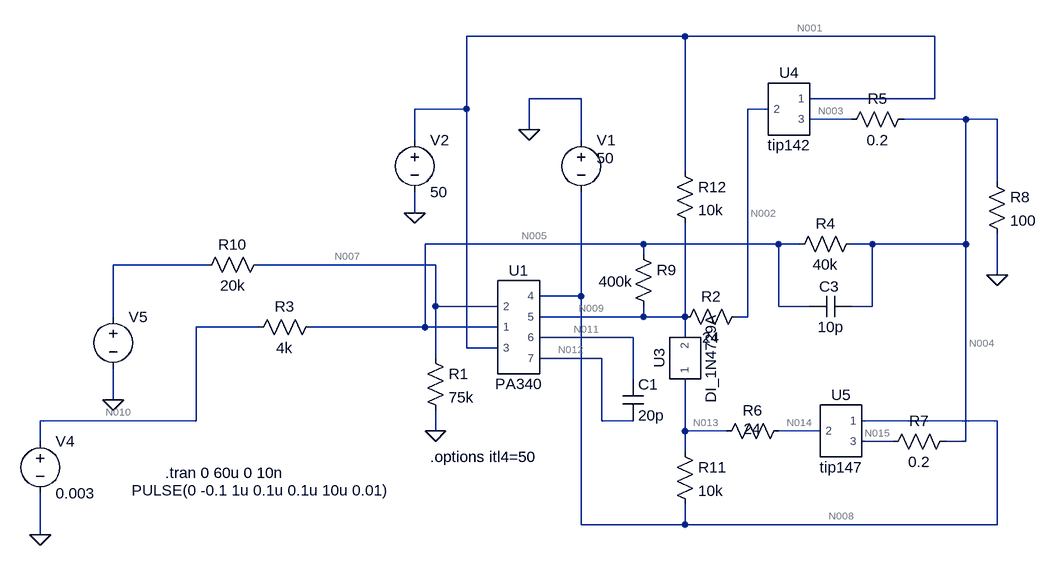
[diagram p0: schematic Draft16.asc]
Draft16.asc, the LTspice schematic file:
Version 4
SHEET 1 1672 680
WIRE 448 -288 112 -288
WIRE 832 -288 448 -288
WIRE 288 -192 208 -192
WIRE 832 -192 832 -288
WIRE 832 -192 640 -192
WIRE 112 -176 112 -288
WIRE 112 -176 32 -176
WIRE 576 -176 544 -176
WIRE 704 -160 640 -160
WIRE 880 -160 784 -160
WIRE 928 -160 880 -160
WIRE 208 -144 208 -192
WIRE 32 -128 32 -176
WIRE 288 -128 288 -192
WIRE 448 -80 448 -288
WIRE 928 -64 928 -160
WIRE 32 -16 32 -48
WIRE 384 32 48 32
WIRE 592 32 384 32
WIRE 624 32 592 32
WIRE 736 32 704 32
WIRE 880 32 880 -160
WIRE 880 32 736 32
WIRE 384 48 384 32
WIRE -288 64 -432 64
WIRE 64 64 -208 64
WIRE 928 80 928 16
WIRE 288 112 288 -48
WIRE 288 112 224 112
WIRE 64 128 64 64
WIRE 160 128 64 128
WIRE 592 128 592 32
WIRE 640 128 592 128
WIRE 736 128 736 32
WIRE 736 128 704 128
WIRE -432 144 -432 64
WIRE 384 144 384 128
WIRE 384 144 224 144
WIRE 448 144 448 0
WIRE 448 144 384 144
WIRE 544 144 544 -176
WIRE 544 144 528 144
WIRE -208 160 -304 160
WIRE 48 160 48 32
WIRE 48 160 -128 160
WIRE 160 160 48 160
WIRE 368 176 224 176
WIRE 448 176 448 144
WIRE 112 192 112 -176
WIRE 160 192 112 192
WIRE 64 208 64 128
WIRE 320 208 224 208
WIRE 368 240 368 176
WIRE -432 272 -432 224
WIRE -304 304 -304 160
WIRE -304 304 -544 304
WIRE 320 304 320 208
WIRE 368 304 320 304
WIRE 928 304 720 304
WIRE 64 320 64 288
WIRE 448 320 448 240
WIRE 512 320 448 320
WIRE 656 320 592 320
WIRE -544 336 -544 304
WIRE 768 336 720 336
WIRE 880 336 880 32
WIRE 880 336 848 336
WIRE 448 352 448 320
WIRE 288 464 288 112
WIRE 448 464 448 432
WIRE 448 464 288 464
WIRE 928 464 928 304
WIRE 928 464 448 464
WIRE -544 480 -544 416
FLAG 32 -16 0
FLAG 208 -144 0
FLAG -544 480 0
FLAG 928 80 0
FLAG -432 272 0
FLAG 64 320 0
SYMBOL PA340 192 160 R0
SYMATTR InstName U1
SYMBOL res 48 192 R0
SYMATTR InstName R1
SYMATTR Value 75k
SYMBOL res 544 128 R90
WINDOW 0 0 56 VBottom 2
WINDOW 3 32 56 VTop 2
SYMATTR InstName R2
SYMATTR Value 24
SYMBOL res -112 144 R90
WINDOW 0 0 56 VBottom 2
WINDOW 3 32 56 VTop 2
SYMATTR InstName R3
SYMATTR Value 4k
SYMBOL cap 352 240 R0
SYMATTR InstName C1
SYMATTR Value 20p
SYMBOL voltage 288 -144 R0
WINDOW 3 24 44 Left 2
WINDOW 123 0 0 Left 0
WINDOW 39 0 0 Left 0
SYMATTR Value 50
SYMATTR InstName V1
SYMBOL voltage 32 -144 R0
WINDOW 123 0 0 Left 0
WINDOW 39 0 0 Left 0
SYMATTR InstName V2
SYMATTR Value 50
SYMBOL res 912 -80 R0
SYMATTR InstName R8
SYMATTR Value 100
SYMBOL res 720 16 R90
WINDOW 0 0 56 VBottom 2
WINDOW 3 32 56 VTop 2
SYMATTR InstName R4
SYMATTR Value 40k
SYMBOL cap 704 112 R90
WINDOW 0 1 34 VBottom 2
WINDOW 3 32 32 VTop 2
SYMATTR InstName C3
SYMATTR Value 10p
SYMBOL res -192 48 R90
WINDOW 0 0 56 VBottom 2
WINDOW 3 32 56 VTop 2
SYMATTR InstName R10
SYMATTR Value 20k
SYMBOL voltage -432 128 R0
WINDOW 123 0 0 Left 0
WINDOW 39 0 0 Left 0
WINDOW 3 29 283 Left 2
SYMATTR Value PULSE(0 -0.1 1u 0.1u 0.1u 10u 0.01)
SYMATTR InstName V5
SYMBOL res 608 304 R90
WINDOW 0 0 56 VBottom 2
WINDOW 3 28 56 VBottom 2
SYMATTR InstName R6
SYMATTR Value 24
SYMBOL voltage -544 320 R0
WINDOW 123 0 0 Left 0
WINDOW 39 0 0 Left 0
SYMATTR InstName V4
SYMATTR Value 0.003
SYMBOL tip142 608 -176 R0
SYMATTR InstName U4
SYMBOL tip147 688 320 R0
SYMATTR InstName U5
SYMBOL res 800 -176 R90
WINDOW 0 0 56 VBottom 2
WINDOW 3 32 56 VTop 2
SYMATTR InstName R5
SYMATTR Value 0.2
SYMBOL res 864 320 R90
WINDOW 0 0 56 VBottom 2
WINDOW 3 32 56 VTop 2
SYMATTR InstName R7
SYMATTR Value 0.2
SYMBOL res 368 32 R0
WINDOW 3 -53 58 Left 2
SYMATTR Value 400k
SYMATTR InstName R9
SYMBOL res 432 336 R0
SYMATTR InstName R11
SYMATTR Value 10k
SYMBOL res 432 -96 R0
SYMATTR InstName R12
SYMATTR Value 10k
SYMBOL 1N4729A 448 208 R270
SYMATTR InstName U3
TEXT -352 384 Left 2 !.tran 0 60u 0 10n
TEXT 56 360 Left 2 !.options itl4=50

The netlist it stands for:
* Draft16.asc
XU1 N007 N005 N001 N008 N009 N011 N012 PA340  ; pins 2 1 3 4 5 6 7
R1 N007 0 75k
R2 N002 N009 24
R3 N005 N010 4k
C1 N011 N012 20p
V1 0 N008 50
V2 N001 0 50
R8 N004 0 100
R4 N004 N005 40k
C3 N004 N005 10p
R10 N007 N006 20k
V5 N006 0 PULSE(0 -0.1 1u 0.1u 0.1u 10u 0.01)
R6 N014 N013 24
V4 N010 0 0.003
XU4 N001 N002 N003 tip142  ; pins 1 2 3
XU5 N008 N014 N015 tip147  ; pins 1 2 3
R5 N004 N003 0.2
R7 N004 N015 0.2
R9 N005 N009 400k
R11 N013 N008 10k
R12 N001 N009 10k
XU3 N013 N009 DI_1N4729A  ; pins 1 2
.tran 0 60u 0 10n
.options itl4=50
.lib PA340_Pspice.LIB
.lib TIP142.cir
.lib TIP147.cir
.lib D:\1-LTspise\BASE_MOSFET\1N4729A.cir
.backanno
.end

* Results of the author's LTspice run, read from the files saved beside the schematic
* Operating Point, zero values left out:
*   V(n001) = 50 V
*   V(n008) = -50 V
*   V(n011) = -1.344 mV
*   V(n012) = 1.68 V
*   V(n009) = 1.662 V
*   V(n005) = 12.03 mV
*   V(n007) = -868.4 nV
*   V(n002) = 1.652 V
*   V(n010) = 3 mV
*   V(n004) = -62.71 mV
*   V(n014) = -1.657 V
*   V(n013) = -1.662 V
*   V(n003) = -59.09 mV
*   V(n015) = -66.45 mV
*   I(R12) = 4.834 mA
*   I(R11) = 4.834 mA
*   I(R9) = -4.125 µA
*   I(R7) = 18.72 mA
*   I(R5) = -18.09 mA
*   I(R6) = 213.8 µA
*   I(R10) = -43.42 pA
*   I(R4) = -1.868 µA
*   I(R8) = -627.1 µA
*   I(R3) = 2.257 µA
*   I(R2) = -417.4 µA
*   I(R1) = -11.58 pA
*   I(V4) = 2.257 µA
*   I(V5) = -43.42 pA
*   I(V2) = -24.76 mA
*   I(V1) = -25.39 mA
*   Ix(u1:2) = 55 pA
*   Ix(u1:1) = 50 pA
*   Ix(u1:3) = 2.26 mA
*   Ix(u1:4) = -2.053 mA
*   Ix(u1:5) = -207.7 µA
*   Ix(u4:1) = 17.67 mA
*   Ix(u4:2) = 417.4 µA
*   Ix(u4:3) = -18.09 mA
*   Ix(u5:1) = -18.5 mA
*   Ix(u5:2) = -213.8 µA
*   Ix(u5:3) = 18.72 mA
*   Ix(u3:1) = -4.62 mA
*   Ix(u3:2) = 4.62 mA
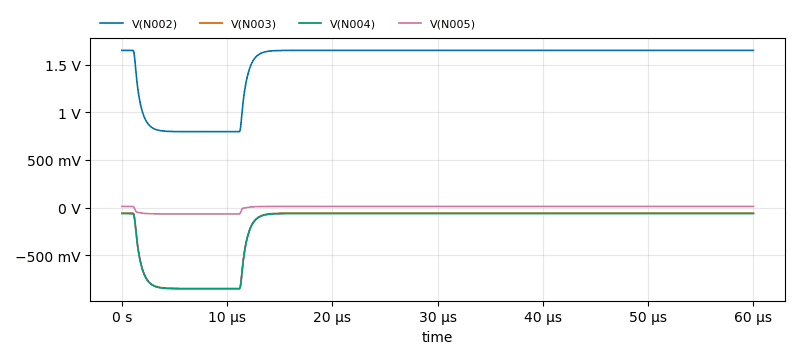
[diagram p1: Transient Analysis of Draft16.asc, plotted from the saved traces]
* Transient Analysis, 1 run:
*   V(N002): min 798 mV, max 1.652 V, average 1.508 V, rms 1.539 V, last 1.652 V
*   V(N003): min -850.2 mV, max -59.09 mV, average -192.2 mV, rms 344.3 mV, last -59.09 mV
*   V(N004): min -853.5 mV, max -62.71 mV, average -195.8 mV, rms 346.2 mV, last -62.71 mV
*   V(N005): min -66.91 mV, max 12.03 mV, average -1.262 mV, rms 28.89 mV, last 12.03 mV